# Altium schematic sheet XS1_SYSTEM.SchDoc: XS1 SYSTEM
size A3; Date: 2011-11-28; Author: S.Choquette; Revision: 2.0; SheetNumber: 2; SheetTotal: 9
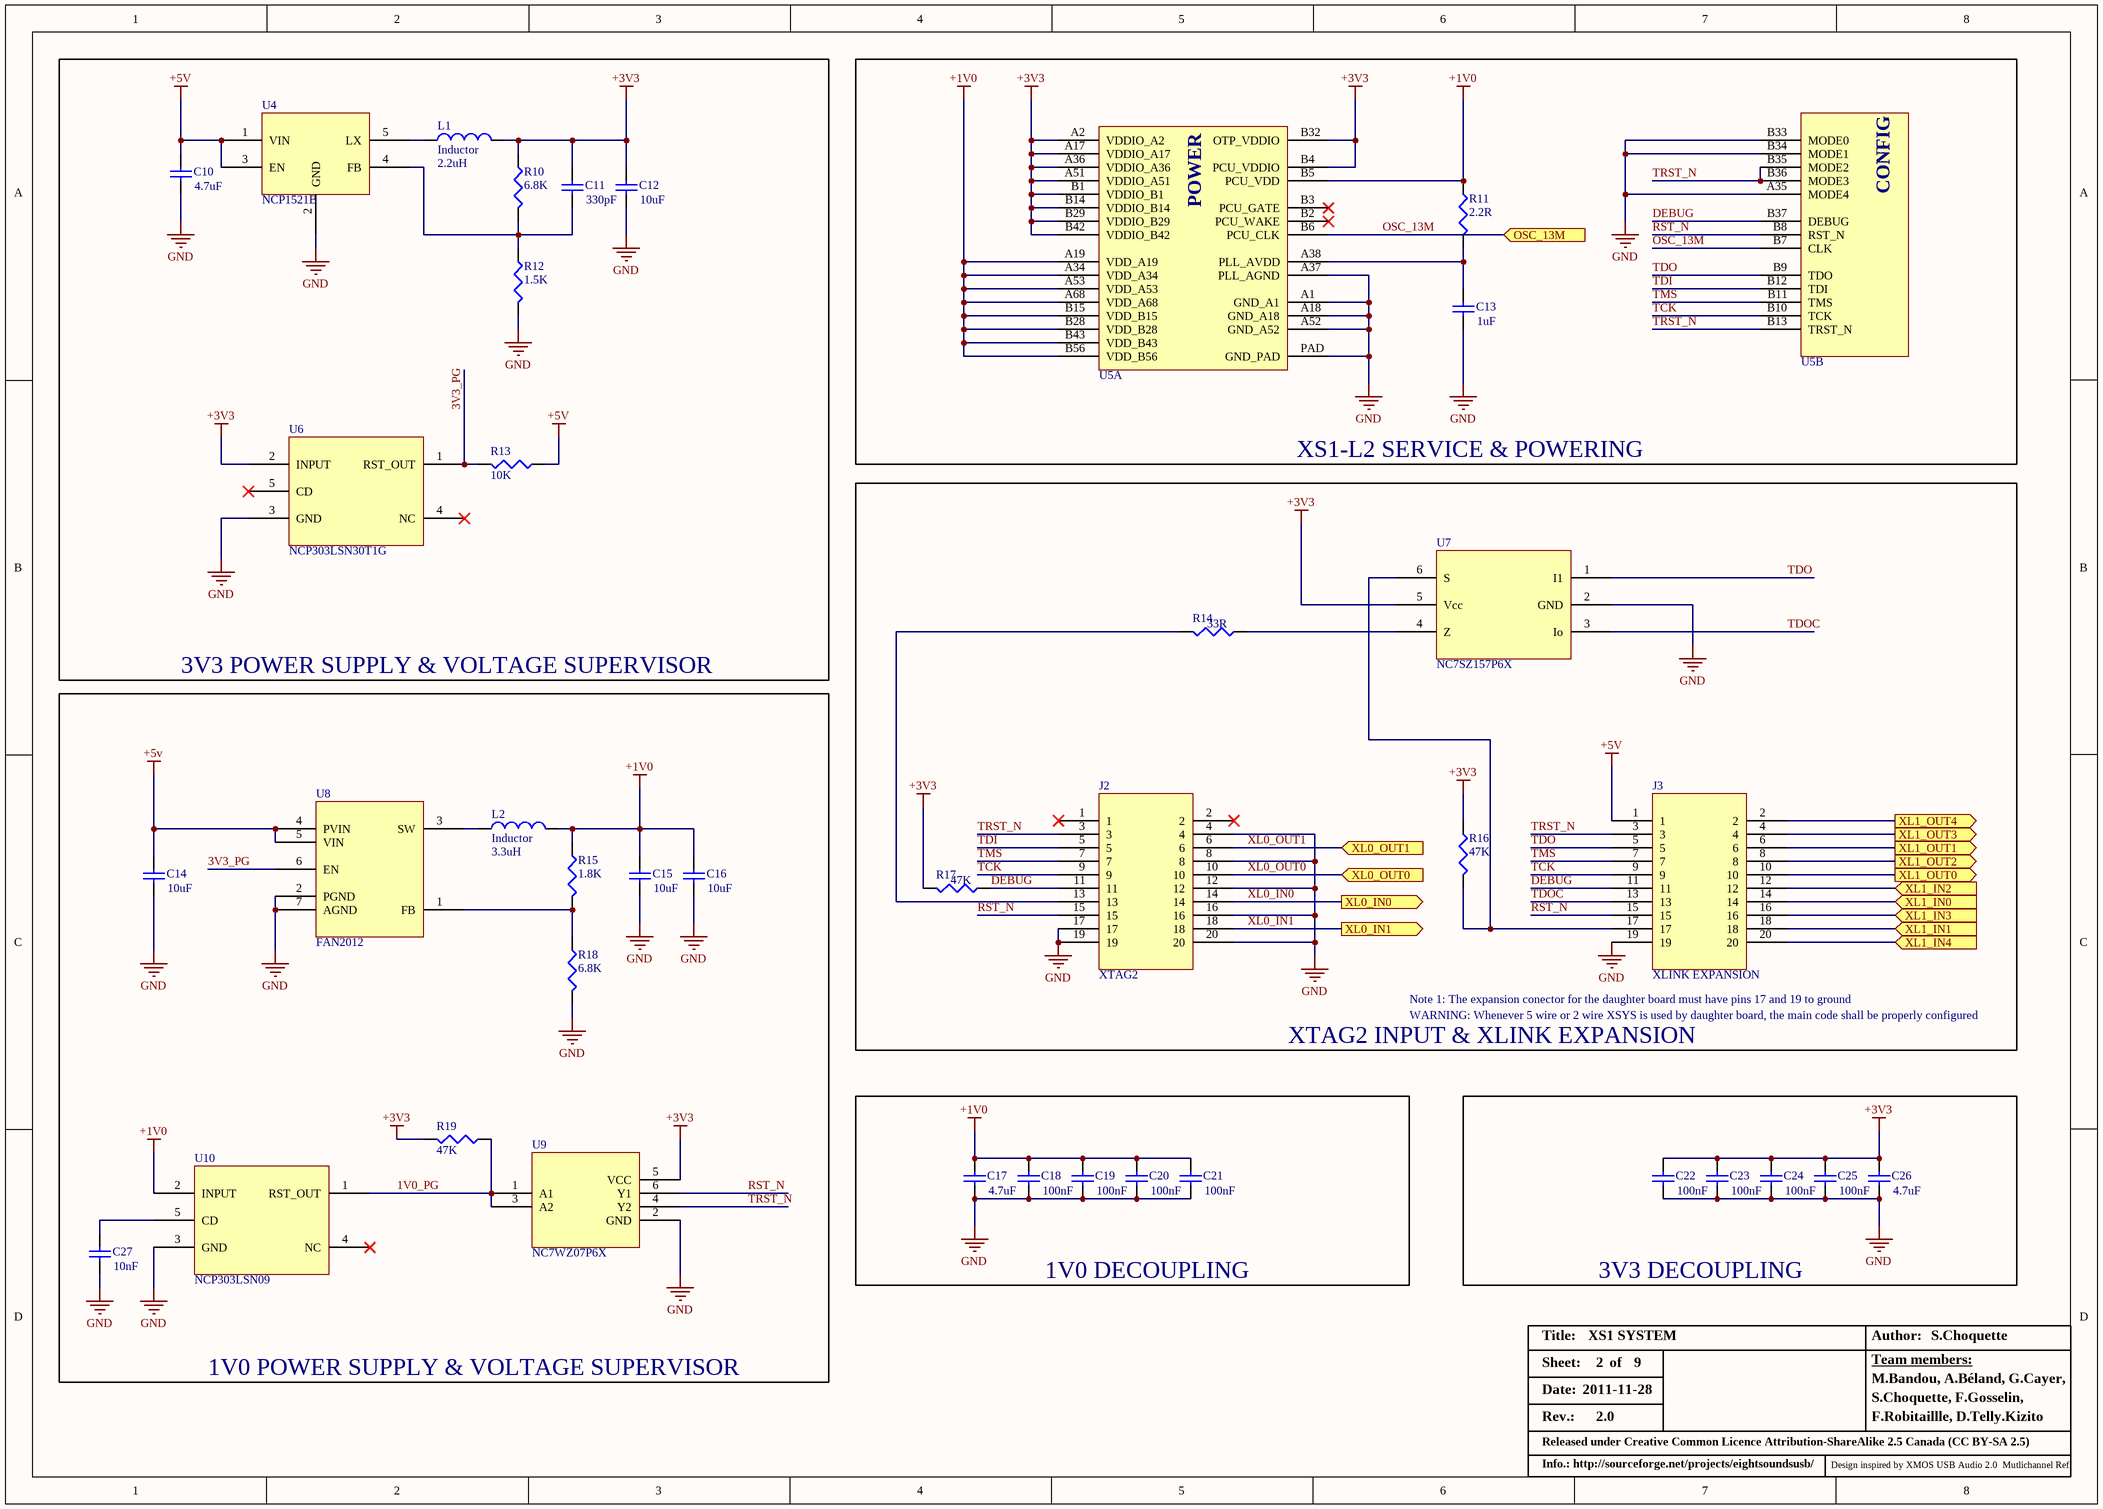
[diagram p0: XS1_SYSTEM.SchDoc]

## Parts
C10  value 4.7uF  [3-0603]
C11  value 330pF  [3-0603]
C12  value 10uF  [6-0805]
C13  value 1uF  [3-0603]
C14  value 10uF  [6-0805]
C15  value 10uF  [6-0805]
C16  value 10uF  [6-0805]
C17  value 4.7uF  [3-0603]
C18  value 100nF  [2-0402]
C19  value 100nF  [2-0402]
C20  value 100nF  [2-0402]
C21  value 100nF  [2-0402]
C22  value 100nF  [2-0402]
C23  value 100nF  [2-0402]
C24  value 100nF  [2-0402]
C25  value 100nF  [2-0402]
C26  value 4.7uF  [3-0603]
C27  value 10nF  [3-0603]
J2  XTAG2  [HEADER-2X10-100mil]
J3  XLINK EXPANSION  [HEADER-2X10-100mil_STRAIGHT]
L1  Inductor  value 2.2uH  [Inductor]
L2  Inductor  value 3.3uH  [INDUCTOR_1515]
R10  value 6.8K  [3-0603]
R11  value 2.2R  [3-0603]
R12  value 1.5K  [3-0603]
R13  value 10K  [3-0603]
R14  value 33R  [3-0603]
R15  value 1.8K  [3-0603]
R16  value 47K  [3-0603]
R17  value 47K  [3-0603]
R18  value 6.8K  [3-0603]
R19  value 47K  [3-0603]
U4  NCP1521B  [SOT23-5AL_MOD(1-07)]
U5  XS1_L2_124QFN  [QFN-124]  (value not drawn)  (parts A,B of 4)
U6  NCP303LSN30T1G  [SOT23-5AL_MOD(1-07)]
U7  NC7SZ157P6X  [SOT363-6L]
U8  FAN2012  [MLP-6-LEAD-3X3mm]
U9  NC7WZ07P6X  [SOT363-6L]
U10  NCP303LSN09  [SOT23-5AL_MOD(1-07)]

## Blocks framed on the sheet
3V3 POWER SUPPLY & VOLTAGE SUPERVISOR: C10-C12 L1 R10 R12 R13 U4 U6
XS1-L2 SERVICE & POWERING: C13 R11 U5
XTAG2 INPUT & XLINK EXPANSION: J2 J3 R14 R16 R17 U7
1V0 POWER SUPPLY & VOLTAGE SUPERVISOR: C14-C16 C27 L2 R15 R18 R19 U8-U10
1V0 DECOUPLING: C17-C21
3V3 DECOUPLING: C22-C26

## Ports
OSC_13M (in), XL0_IN0 (out), XL0_IN1 (out), XL0_OUT0 (in), XL0_OUT1 (in), XL1_IN0 (in), XL1_IN1 (in), XL1_IN2 (in), XL1_IN3 (in), XL1_IN4 (in), XL1_OUT0 (out), XL1_OUT1 (out), XL1_OUT2 (out), XL1_OUT3 (out), XL1_OUT4 (out)

## Nets
+1V0: C15.2 C16.2 C17.2 C18.2 C19.2 C20.2 C21.2 L2.2 R11.1 R15.1 U5.A19(VDD_A19) U5.A34(VDD_A34) U5.A53(VDD_A53) U5.A68(VDD_A68) U5.B5(PCU_VDD) U5.B15(VDD_B15) U5.B28(VDD_B28) U5.B43(VDD_B43) U5.B56(VDD_B56) U10.2(INPUT)
+3V3: C11.2 C12.2 C22.2 C23.2 C24.2 C25.2 C26.2 L1.2 R10.1 R16.1 R17.2 R19.2 U5.A2(VDDIO_A2) U5.A17(VDDIO_A17) U5.A36(VDDIO_A36) U5.A51(VDDIO_A51) U5.B1(VDDIO_B1) U5.B4(PCU_VDDIO) U5.B14(VDDIO_B14) U5.B29(VDDIO_B29) U5.B32(OTP_VDDIO) U5.B42(VDDIO_B42) U6.2(INPUT) U7.5(Vcc) U9.5(VCC)
+5v: C10.2 C14.2 J3.1 R13.1 U4.1(VIN) U4.3(EN) U8.4(PVIN) U8.5(VIN)
GND: C10.1 C12.1 C13.1 C14.1 C15.1 C16.1 C17.1 C18.1 C19.1 C20.1 C21.1 C22.1 C23.1 C24.1 C25.1 C26.1 C27.1 J2.4 J2.8 J2.12 J2.16 J2.17 J2.19 J2.20 J3.19 R12.2 R18.2 U4.2(GND) U5.A1(GND_A1) U5.A18(GND_A18) U5.A35(MODE4) U5.A37(PLL_AGND) U5.A52(GND_A52) U5.B33(MODE0) U5.B34(MODE1) U5.PAD(GND_PAD) U6.3(GND) U7.2(GND) U8.2(PGND) U8.7(AGND) U9.2(GND) U10.3(GND)
1V0_PG: R19.1 U9.1(A1) U9.3(A2) U10.1(RST_OUT)
3V3_PG: R13.2 U6.1(RST_OUT) U8.6(EN)
DEBUG: J2.11 J3.11 R17.1 U5.B37(DEBUG)
OSC_13M: U5.B6(PCU_CLK) U5.B7(CLK) ; port OSC_13M
RST_N: J2.15 J3.15 U5.B8(RST_N) U9.6(Y1)
TCK: J2.9 J3.9 U5.B10(TCK)
TDI: J2.5 U5.B12(TDI)
TDO: J3.5 U5.B9(TDO) U7.1(I1)
TDOC: J3.13 U7.3(Io)
TMS: J2.7 J3.7 U5.B11(TMS)
TRST_N: J2.3 J3.3 U5.B13(TRST_N) U5.B35(MODE2) U5.B36(MODE3) U9.4(Y2)
XL0_IN0: J2.14 ; port XL0_IN0
XL0_IN1: J2.18 ; port XL0_IN1
XL0_OUT0: J2.10 ; port XL0_OUT0
XL0_OUT1: J2.6 ; port XL0_OUT1
XL1_IN0: J3.14 ; port XL1_IN0
XL1_IN1: J3.18 ; port XL1_IN1
XL1_IN2: J3.12 ; port XL1_IN2
XL1_IN3: J3.16 ; port XL1_IN3
XL1_IN4: J3.20 ; port XL1_IN4
XL1_OUT0: J3.10 ; port XL1_OUT0
XL1_OUT1: J3.6 ; port XL1_OUT1
XL1_OUT2: J3.8 ; port XL1_OUT2
XL1_OUT3: J3.4 ; port XL1_OUT3
XL1_OUT4: J3.2 ; port XL1_OUT4
NetC11_1: C11.1 R10.2 R12.1 U4.4(FB)
NetC13_2: C13.2 R11.2 U5.A38(PLL_AVDD)
NetC27_2: C27.2 U10.5(CD)
NetJ2_13: J2.13 R14.2
NetJ3_17: J3.17 R16.2 U7.6(S)
NetL1_1: L1.1 U4.5(LX)
NetL2_1: L2.1 U8.3(SW)
NetR14_1: R14.1 U7.4(Z)
NetR15_2: R15.2 R18.1 U8.1(FB)

Not connected (* = marked no-connect by the designer): J2 1* 2*; U5 B2(PCU_WAKE)* B3(PCU_GATE)*; U6 4(NC)* 5(CD)*; U10 4(NC)*

## Notes on the sheet
- (near J3) Note 1: The expansion conector for the daughter board must have pins 17 and 19 to ground
- WARNING: Whenever 5 wire or 2 wire XSYS is used by daughter board, the main code shall be properly configured
- Title:
- Date:
- Sheet:
- of
- Author:
- Team members:
- M.Bandou, A.Béland, G.Cayer,
- Rev.:
- Released under Creative Common Licence Attribution-ShareAlike 2.5 Canada (CC BY-SA 2.5)
- S.Choquette, F.Gosselin,
- F.Robitaillle, D.Telly.Kizito
- Info.: http://sourceforge.net/projects/eightsoundsusb/
- Design inspired by XMOS USB Audio 2.0  Mutlichannel Ref.
- (in symbol XS1_L2_124QFN, part A) POWER
- (in symbol XS1_L2_124QFN, part B) CONFIG

## Library data of the parts
C10 C17 C26 = Cap: MLCC 4.7uF 0603 X5R 6.3V; Manufacturer: Murata; Part Number: GRM188R60J475KE19; Cost: *
C11 = Cap: MLCC 330pF 0603 COG 50V; Manufacturer: Murata; Part Number: GRM1885C1H331JA01; Cost: 0,005
C12 C14-C16 = Cap: MLCC 10uF 0805 X5R 10V; Manufacturer: Murata; Part Number: GRM21BR61A106KE19; Cost: 0,005
C13 = Cap: MLCC 1uF 0603 X5R 10V; Manufacturer: Murata; Part Number: GRM188R61A105KA61; Cost: 0,005
C18-C25 = Cap: MLCC 100nF 0402 X7R 16V; Manufacturer: Murata; Part Number: GRM155R71C104KA88; Cost: 0,005
C27 = Cap: MLCC 10nF 0603 X7R 50V; Manufacturer: Murata; Part Number: GRM188R71H103KA01; Cost: 0,005
J2 = HEADER-2X10: IDC Boxed Header, Right Angle, PCB Mount, Polarised, 20 Way, 2x10, 0.1" Pitch; Manufacturer: Sullins; Part Number: SBH11-PBPC-D10-RA-BK; Cost: *
J3 = HEADER-2X10_STRAIGHT: IDC Header Female, Straight, PCB Mount, Polarised, 20 Way, 2x10, 0.1" Pitch; Manufacturer: Sullins; Part Number: SFH11-PBPC-D10-ST-BK
L1 = Inductor: Power Inductor, 2.2uH, 0.7A, 260mR DCR; Manufacturer: Taiyo Yuden; Part Number: CBC2016T2R2M; Code_IEC: 1005; Code_JEITA: 0402; Cost: *
L2 = Inductor: Power Inductor, 3.3uH, 1.7A, 78mR DCR; Manufacturer: Murata; Part Number: LQH44PN3R3MP0; Cost: *
R10 R18 = Res3: RES 6.8k 0603 1%; Manufacturer: ROHM; Part Number: MCR03EZPFX6801; Cost: *
R11 = Res3: RES 2.2R 0603 1%; Manufacturer: ROHM; Part Number: MCR03EZPJ2R2; Cost: *
R12 = Res3: RES 1.5k 0603 1%; Manufacturer: ROHM; Part Number: MCR03EZPFX1501; Cost: *
R13 = Res3: RES 10k 0603 1%; Manufacturer: ROHM; Part Number: MCR03EZPFX1002; Cost: *
R14 = Res3: RES 33R 0603 1%; Manufacturer: ROHM; Part Number: MCR03EZPFX33R0; Cost: *
R15 = Res3: RES 1.8k 0603 1%; Manufacturer: ROHM; Part Number: MCR03EZPFX1801; Cost: *
R16 R17 R19 = Res3: RES 47k 0603 1%; Manufacturer: ROHM; Part Number: MCR03EZPFX4702; Cost: *
U4 = NCP1521B: 1.5 MHz, 600 mA Step-Down  DC-DC Converter; Manufacturer: ON Semiconductor; Part Number: NCP1521B; Cost: *
U5 = XS1_L2_124QFN: Event-driven dual-core processor XS1-L2 124QFN; Manufacturer: XMOS; Part Number: XS1-L02A-QF124-C4; Cost: *
U6 = NCP303LSN30: Voltage Detector Series with Programmable Delay; Manufacturer: ON Semiconductor; Part Number: NCP303LSN30T1G; Cost: *
U7 = NC7SZ157: TinyLogic UHS 2 Input Non-Inverting Multiplexer; Manufacturer: Fairchild; Part Number: NC7SZ157P6X; Cost: *
U8 = FAN2012: 1.5A Low Voltage Current Mode Synchronous PWM Buck  Regulator; Manufacturer: Fairchild; Part Number: FAN2012; Cost: *
U9 = NC7WZ07: TinyLogic UHS Dual Buffer; Manufacturer: Fairchild; Part Number: NC7WZ07P6X; Cost: *
U10 = NCP303LSN09: Voltage Detector Serieswith Programmable Delay; Manufacturer: ON Semiconductor; Part Number: NCP303LSN09T1G; Cost: *